# Altium schematic sheet charger.SchDoc
size A3
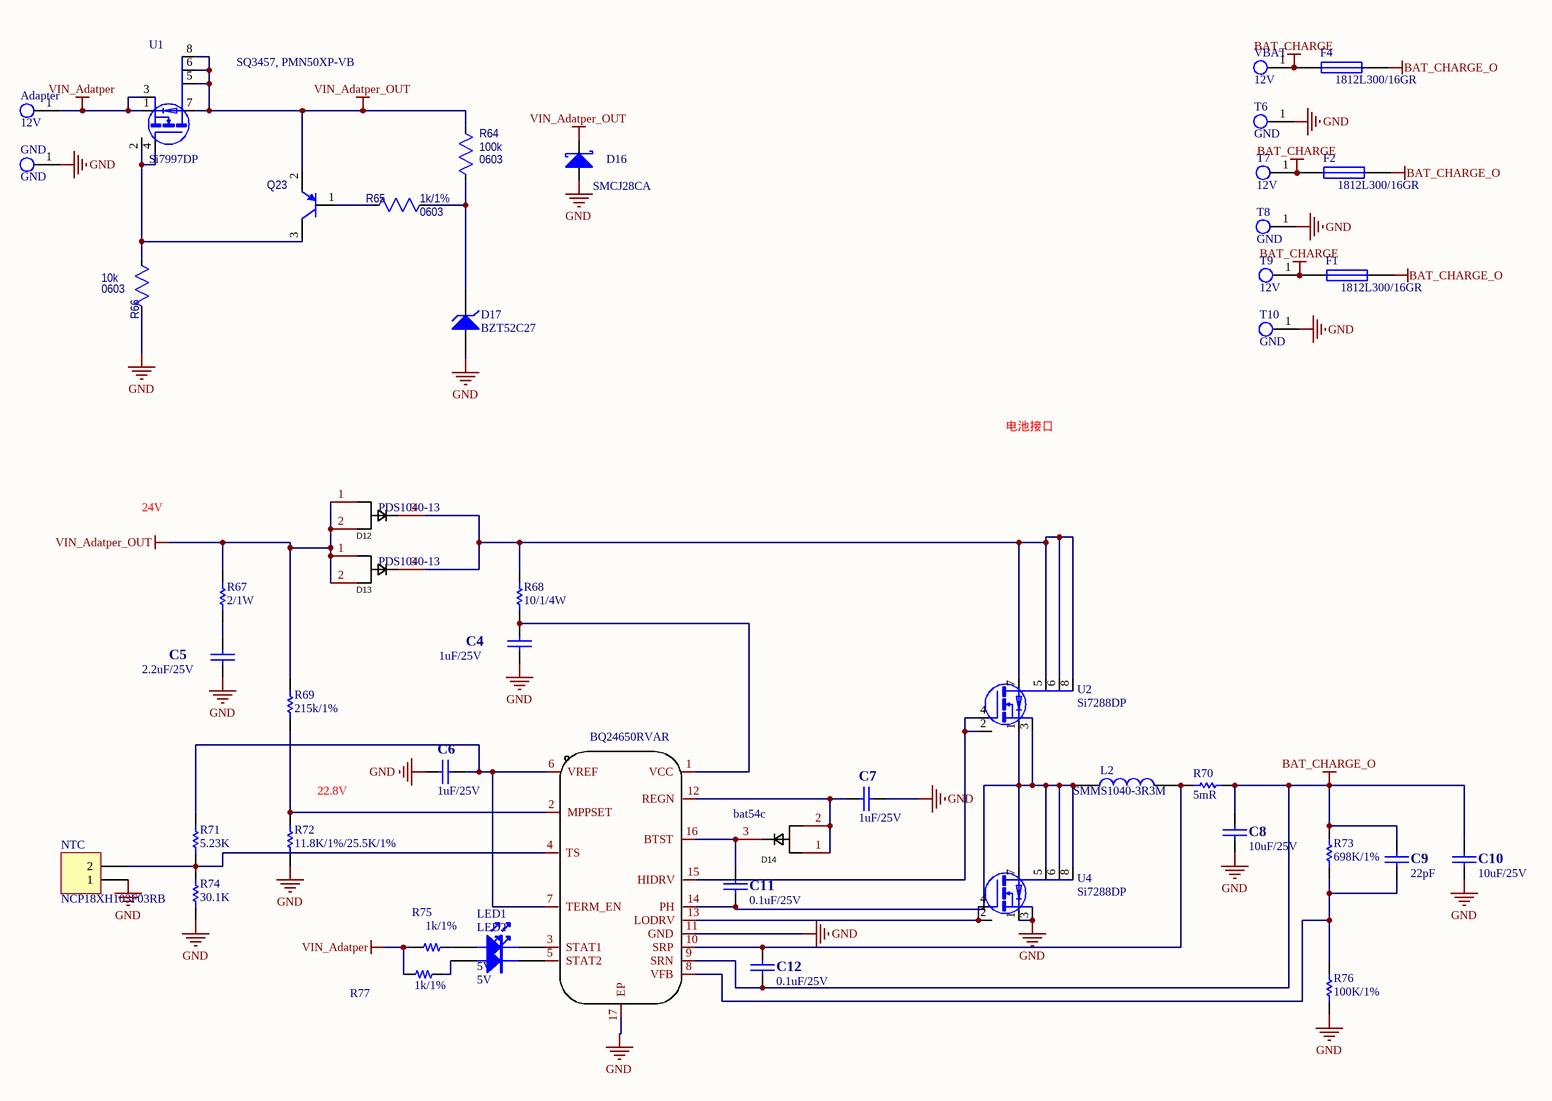
[diagram p0: charger.SchDoc]

## Parts
Adapter  12V  [FIX-4.5]
C4  1uF/25V  [0805C]
C5  2.2uF/25V  [1210C]
C6  1uF/25V  [0603C]
C7  1uF/25V  [0603C]
C8  10uF/25V  [0603C]
C9  22pF  [0603C]
C10  10uF/25V  [0603C]
C11  0.1uF/25V  [0603C]
C12  0.1uF/25V  [0603C]
D12  PDS1040-13  [POWERDI-5_L5.4-W4.0-LS6.5-RD]
D13  PDS1040-13  [POWERDI-5_L5.4-W4.0-LS6.5-RD]
D14  bat54c  [sot23-3]
D16  SMCJ28CA  [SMC]
D17  BZT52C27  [sod123]
F1  1812L300/16GR  [1812-F]
F2  1812L300/16GR  [1812-F]
F4  1812L300/16GR  [1812-F]
GND  GND  [FIX-4.5]
L2  SMMS1040-3R3M  [MSS1038]
LED1  5V  [0603LED]
LED2  5V  [0603LED]
NTC  NCP18XH103F03RB  [HDR1X2]
Q23  MMBT4403-7-F  [SOT23-3]  (value not drawn)
R64  Package: 0603  [RESC1608X055N_0603]  (hidden comment: 100k)
R65  Package: 0603  [RESC1608X055N_0603]  (hidden comment: 1k/1%)
R66  Package: 0603  [RESC1608X055N_0603]  (hidden comment: 10k)
R67  2/1W  [2512R]
R68  10/1/4W  [1206R]
R69  215k/1%  [0603R]
R70  5mR  [2512R]
R71  5.23K  [0603R]
R72  11.8K/1%/25.5K/1%  [0603R]
R73  698K/1%  [0603R]
R74  30.1K  [0603R]
R75  1k/1%  [0603R]
R76  100K/1%  [0603R]
R77  1k/1%  [0603R]
T6  GND  [FIX-4.5]
T7  12V  [FIX-4.5]
T8  GND  [FIX-4.5]
T9  12V  [FIX-4.5]
T10  GND  [FIX-4.5]
U1  Si7997DP  [PowerPAK SO-8]
U2  Si7288DP  [PowerPAK SO-8]
U4  Si7288DP  [PowerPAK SO-8]
U5  BQ24650RVAR  [VQFN-16_L3.6-W3.6-P0.50-BL-EP]
VBAT  12V  [FIX-4.5]

## Nets
BAT_CHARGE: F1.1 F2.1 F4.1 T7.1 T9.1 VBAT.1
BAT_CHARGE_O: C8.2 C9.2 C10.2 C12.1 F1.2 F2.2 F4.2 R70.2 R73.1 U5.9(SRN)
GND: C4.2 C5.2 C6.1 C7.2 C8.1 C10.1 D16.1(A) D17.1(A) GND.1 NTC.1 R66.2 R72.2 R74.2 R76.2 T6.1 T8.1 T10.1 U4.1(S) U4.3(S) U5.11(GND) U5.17(EP)
VIN_Adatper: Adapter.1 R75.2 R77.2 U1.1(S) U1.3(S)
VIN_Adatper_OUT: D12.1(LEFT) D12.2(RIGHT) D13.1(LEFT) D13.2(RIGHT) D16.2(K) Q23.2(E) R64.2 R67.1 R69.1 U1.5(D) U1.6(D) U1.7(D) U1.8(D)
NetC4_1: C4.1 R68.2 U5.1(VCC)
NetC5_1: C5.1 R67.2
NetC6_2: C6.2 R71.1 U5.6(VREF) U5.7(TERM_EN)
NetC7_1: C7.1 D14.1(LEFT) D14.2(RIGHT) U5.12(REGN)
NetC9_1: C9.1 R73.2 R76.1 U5.8(VFB)
NetC11_1: C11.1 L2.1 U2.1(S) U2.3(S) U4.5(D) U4.6(D) U4.7(D) U4.8(D) U5.14(PH)
NetC11_2: C11.2 D14.3 U5.16(BTST)
NetC12_2: C12.2 L2.2 R70.1 U5.10(SRP)
NetD12_3: D12.3 D13.3 R68.1 U2.5(D) U2.6(D) U2.7(D) U2.8(D)
NetD17_2: D17.2(K) R64.1 R65.1
NetLED1_1: LED1.1 R75.1
NetLED1_2: LED1.2 U5.3(STAT1)
NetLED2_1: LED2.1 R77.1
NetLED2_2: LED2.2 U5.5(STAT2)
NetNTC_2: NTC.2 R71.2 R74.1 U5.4(TS)
NetQ23_1: Q23.1(B) R65.2
NetQ23_3: Q23.3(C) R66.1 U1.2(G) U1.4(G)
NetR69_2: R69.2 R72.1 U5.2(MPPSET)
NetU2_2: U2.2(G) U2.4(G) U5.15(HIDRV)
NetU4_2: U4.2(G) U4.4(G) U5.13(LODRV)

## Notes on the sheet
- SQ3457, PMN50XP-VB
- 电池接口
- 24V
- (near R72) 22.8V

## Library data of the parts
Adapter GND T6-T10 VBAT = TP
C4-C12 = CAP: Capacitor
D12-D14 = PDS1040-13: Manufacturer: DIODES(美台); Add into BOM: yes; Forward Voltage (Vf@If): 510mV@10A; Reverse Voltage (Vr): 40V; Average Rectified Current (Io): 10A; Symbol: PDS1040-13; Device: PDS1040-13; LCSC Part Name: 电压:40V 电流:10A; Supplier Part: C110512; Manufacturer Part: PDS1040-13; Supplier Footprint: Power-DI-5; JLCPCB Part Class: Extended Part; Datasheet: https://atta.szlcsc.com/upload/public/pdf/source/20170427/1493286399327.pdf; Supplier: LCSC; Convert to PCB: yes
D16 = DIODE S: Schottky Diode
D17 = BZT52C12S-7-F: Zener Current: 5mA; Vz - Zener Voltage: 12V; Pd - Power Dissipation: 200mW; Zz - Zener Impedance: 40Ohms; Unit Weight: 0.000173oz; Voltage Temperature Coefficient: 0.25mV/C; Voltage Tolerance: 5%; Package Reference: SOD323-2; Minimum Operating Temperature: -65C; Packaging: Reel; Product Category: ZenerDiodes; Termination Style: SMD/SMT; Mounting Style: SMD/SMT; RoHS: True; Package / Case: SOD-323; Package Description: 2-Pin Surface Mount Device, Body 1.7 x 1.3 mm; Width: 1.4mm; Mounting Technology: SurfaceMount; Package URL: http://www.vishay.com/docs/71192/71192.pdf; Series: BZT52C12; Value: BZT52C12S-7-F
F1 F2 F4 = Fuse 1: Fuse; Published: 8-Jun-2000; LatestRevisionDate: 17-Jul-2002; LatestRevisionNote: Re-released for DXP Platform.; PackageReference: PIN-W2/E2.8; Publisher: Altium Limited; PackageDescription: Thru-Hole; 2 Leads
L2 = INDUCTOR
LED1 LED2 = LED
NTC = Header 2: XH2.54 2P 立贴; LatestRevisionDate: 17-Jul-2002; LatestRevisionNote: Re-released for DXP Platform.; Publisher: Altium Limited
Q23 = OEM_Diodes_MMBT4403: Supplier 1: *; Supplier Part Number 1: *; Value: MMBT4403-7-F
R64 = Resistor_0603: PartNumber: RC0603FR-0716K9L; Power Rating: [power]; TempCo: [tempco]; Tolerance: tol; Value: 100k; SupplierDescription: RES SMD 16.9K OHM 1% 1/10W 0603
R65 R66 = Resistor_0603: PartNumber: RC0603FR-071KL; Power Rating: [power]; TempCo: [tempco]; Tolerance: tol; SupplierDescription: RES SMD 1K OHM 1% 1/10W 0603
  R65: Value: 1k/1%
  R66: Value: 10k
R67-R74 R76 = Res1: Resistor; Published: 8-Jun-2000; LatestRevisionDate: 17-Jul-2002; LatestRevisionNote: Re-released for DXP Platform.; PackageReference: AXIAL-0.3; Publisher: Altium Limited
R75 R77 = R: Value: 1k/1%
U1 U2 U4 = Si7997DP: Sia430DJ
U5 = BQ24650RVAR: Manufacturer: TI(德州仪器); Add into BOM: yes; Symbol: BQ24650RVAR; Device: BQ24650RVAR; Supplier: LCSC; Manufacturer Part: BQ24650RVAR; Supplier Part: C53712; JLCPCB Part Class: Extended Part; LCSC Part Name: BQ24650RVAR; Supplier Footprint: VQFN-16-EP(3.6x3.6); Datasheet: https://www.ti.com/cn/lit/gpn/bq24650; Convert to PCB: yes